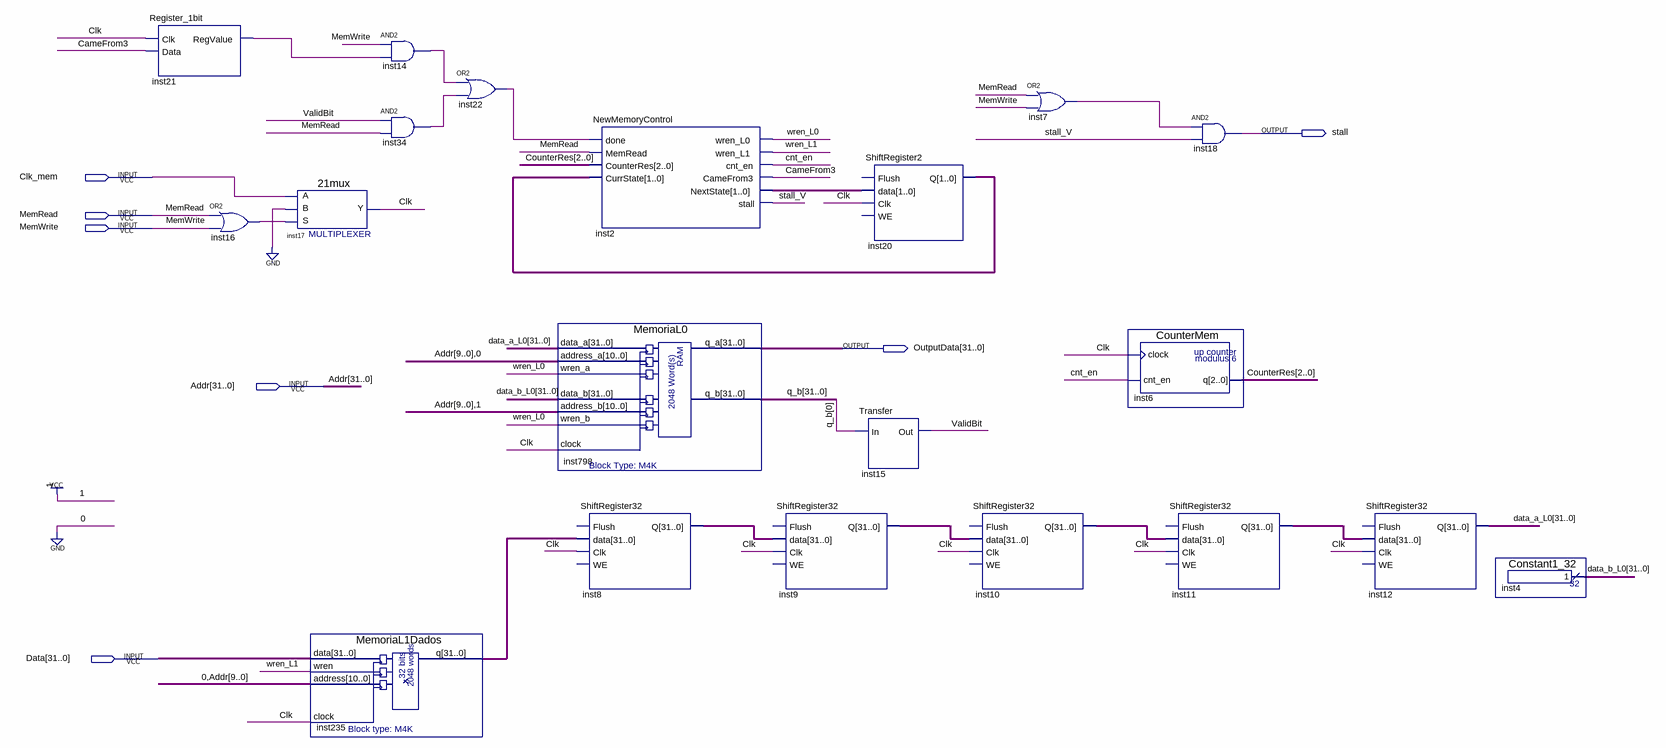
[diagram p0: schematic sheet]
// Quartus schematic NovaMemoriaDeDados.bdf as structural Verilog: 20 symbols, 7 pins
module NovaMemoriaDeDados (
  input  Clk_mem,
  input  MemRead,
  input  MemWrite,
  input  [31:0] Addr,
  input  [31:0] Data,
  output stall,
  output [31:0] OutputData
);

  wire CameFrom3, Clk, cnt_en, inst7_out, inst14_out, inst16_out, inst21_regvalue, inst22_out, inst34_out,
       stall_V, ValidBit, wren_L0, wren_L1;
  wire [1:0] inst2_nextstate, inst20_q;
  wire [2:0] CounterRes;
  wire [31:0] data_a_L0, data_b_L0, inst8_q, inst9_q, inst10_q, inst11_q, inst235_q, q_b;

  Register_1bit inst21 (.Clk(Clk), .Data(CameFrom3), .RegValue(inst21_regvalue));
  or inst16 (inst16_out, MemRead, MemWrite);
  \21mux  inst17 (.S(inst16_out), .B(1'b0), .A(Clk_mem), .Y(Clk));
  MemoriaL1Dados inst235 (.data(Data), .wren(wren_L1), .address({1'b0, Addr[9:0]}), .clock(Clk), .q(inst235_q));
  and inst14 (inst14_out, MemWrite, inst21_regvalue);
  and inst34 (inst34_out, ValidBit, MemRead);
  or inst22 (inst22_out, inst14_out, inst34_out);
  NewMemoryControl inst2 (
    .done(inst22_out), .MemRead(MemRead), .CounterRes(CounterRes), .CurrState(inst20_q), .wren_L0(wren_L0),
    .wren_L1(wren_L1), .cnt_en(cnt_en), .CameFrom3(CameFrom3), .NextState(inst2_nextstate), .stall(stall_V));
  MemoriaL0 inst798 (
    .data_a(data_a_L0), .address_a({Addr[9:0], 1'b0}), .wren_a(wren_L0), .data_b(data_b_L0),
    .address_b({Addr[9:0], 1'b1}), .wren_b(wren_L0), .clock(Clk), .q_a(OutputData), .q_b(q_b));
  ShiftRegister32 inst8 (.data(inst235_q), .Clk(Clk), .Q(inst8_q));  // open: Flush, WE
  ShiftRegister32 inst9 (.data(inst8_q), .Clk(Clk), .Q(inst9_q));  // open: Flush, WE
  ShiftRegister2 inst20 (.data(inst2_nextstate), .Clk(Clk), .Q(inst20_q));  // open: Flush, WE
  Transfer inst15 (.In(q_b[0]), .Out(ValidBit));
  ShiftRegister32 inst10 (.data(inst9_q), .Clk(Clk), .Q(inst10_q));  // open: Flush, WE
  or inst7 (inst7_out, MemRead, MemWrite);
  CounterMem inst6 (.clock(Clk), .cnt_en(cnt_en), .q(CounterRes));
  and inst18 (stall, inst7_out, stall_V);
  ShiftRegister32 inst11 (.data(inst10_q), .Clk(Clk), .Q(inst11_q));  // open: Flush, WE
  ShiftRegister32 inst12 (.data(inst11_q), .Clk(Clk), .Q(data_a_L0));  // open: Flush, WE
  Constant1_32 inst4 (.result(data_b_L0));
endmodule
